# Altium schematic sheet PWM to DC.SchDoc
size 68 x 27 mm
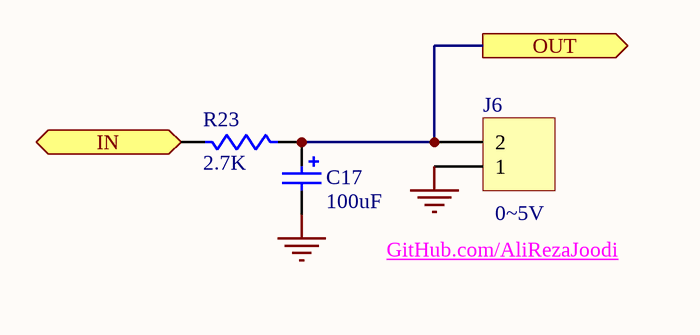
[diagram p0: PWM to DC.SchDoc]

## Parts
C17  value 100uF  [CAPPR2.5-6.3x5]  (hidden comment: C17)
J6  J6  [Fonics_2PIN_1]  (value not drawn)
R23  value 2.7K  [AXIAL-0.4]  (hidden comment: R23)

## Ports
IN (in), OUT (out)

## Nets
GND: C17.2 J6.1
IN: R23.2 ; port IN
OUT: C17.1 J6.2 R23.1 ; port OUT

## Notes on the sheet
- GitHub.com/AliRezaJoodi
- (near J6) 0~5V

## Library data of the parts
C17 = Cap Pol1: Polarized Capacitor (Radial); Manufacturer: Generic Components; Class I: Passive; Published: 8-Jun-2000; Revision: July-2002: Re-released for DXP Platform.; Publisher: Altium Limited; Class II: Capacitor
J6 = Header 2: Header, 2-Pin; LatestRevisionDate: 17-Jul-2002; LatestRevisionNote: Re-released for DXP Platform.; Publisher: Altium Limited
R23 = Res1: Resistor; Manufacturer: Generic Components; Class I: Passive; Published: 8-Jun-2000; Revision: July-2002: Re-released for DXP Platform.; Publisher: Altium Limited; Class II: Resistor